# Altium schematic sheet ST_All.SchDoc
size A4
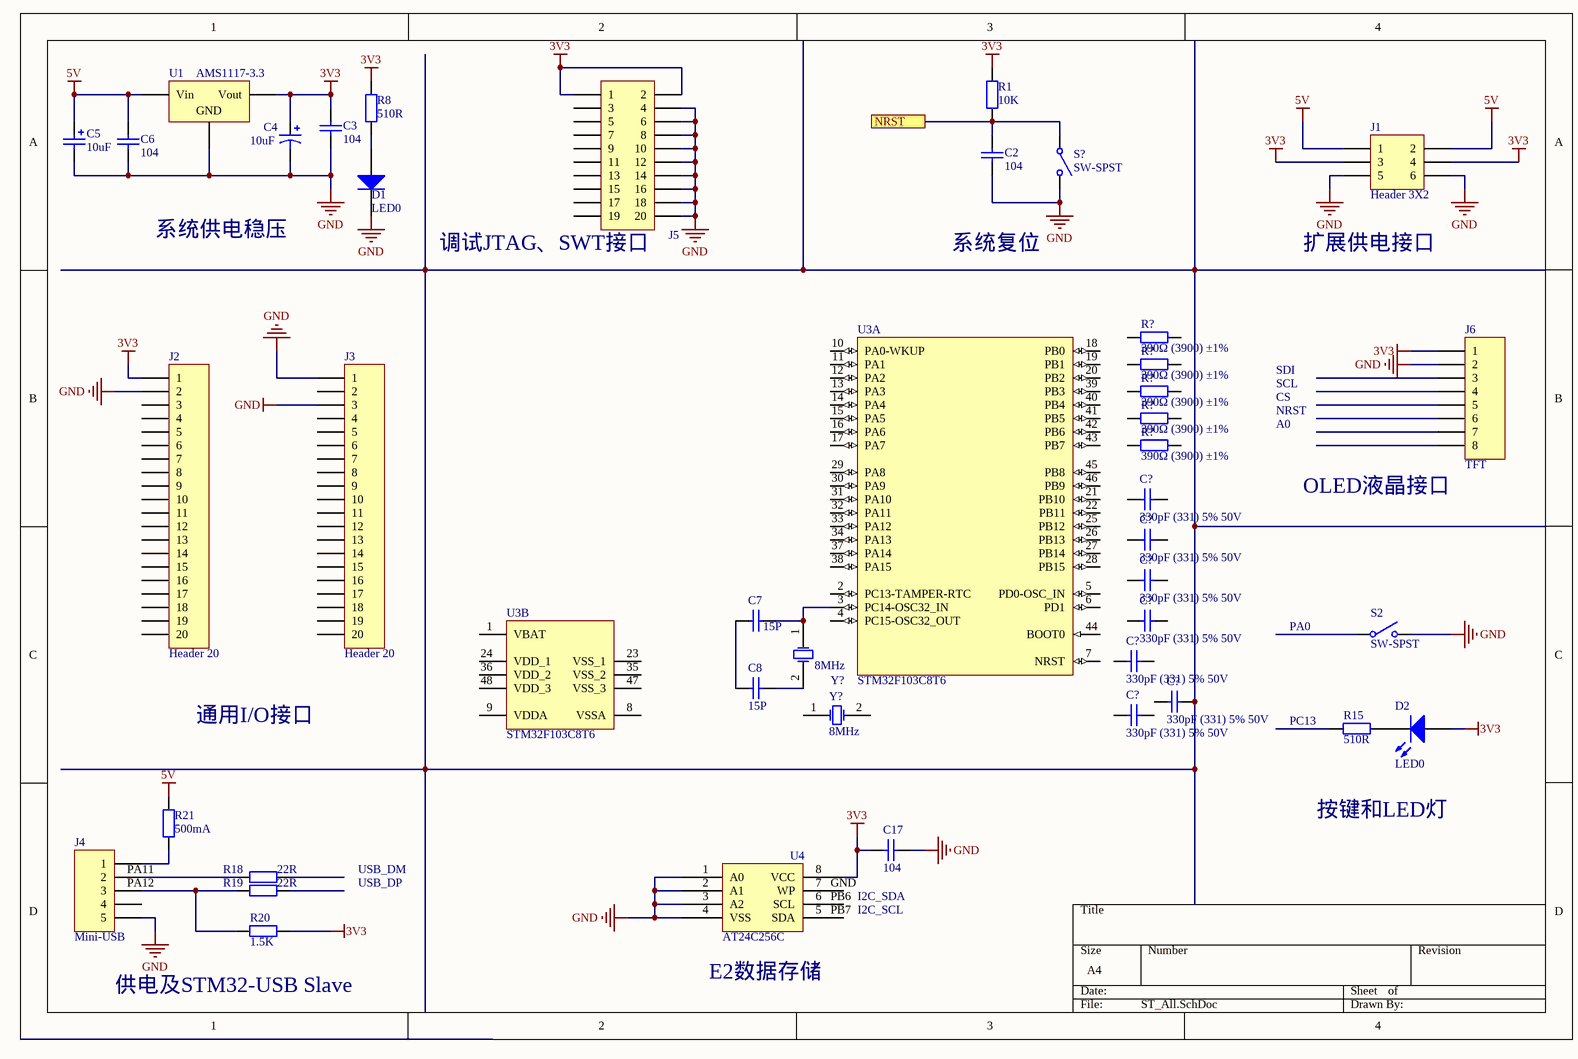
[diagram p0: ST_All.SchDoc]

## Parts
(Parts that share a designator on the sheet are numbered #1, #2 ... from top to bottom, then left to right.)
C2  104  [0603_C]
C3  104  [0402_C]
C4  10uF  [CC6.56.5]
C5  10uF  [CASE-B_3528]
C6  104  [0402_C]
C7  15P  [0603_C]
C8  15P  [0603_C]
C17  104  [0402_C]
C?#1  330pF (331) 5% 50V  [0603_C]
C?#2  330pF (331) 5% 50V  [0603_C]
C?#3  330pF (331) 5% 50V  [0603_C]
C?#4  330pF (331) 5% 50V  [0603_C]
C?#5  330pF (331) 5% 50V  [0603_C]
C?#6  330pF (331) 5% 50V  [0603_C]
C?#7  330pF (331) 5% 50V  [0603_C]
D1  LED0  [SMC(DO-214AB)_S1]
D2  LED0  [0603_LED_S1]
J1  Header 3X2  [MHDR2X3]
J2  Header 20  [HDR1X20]
J3  Header 20  [HDR1X20]
J4  Mini-USB  [HDR1X5]
J5  (no value)  [MHDR2X10]
J6  TFT  [MHDR1X8]
R1  10K  [0603_R]
R8  510R  [0402_R]
R15  510R  [0805_R]
R18  22R  [0402_R]
R19  22R  [0402_R]
R20  1.5K  [0402_R]
R21  500mA  [0402_R]
R?#1  390Ω (3900) ±1%  [0603_R]
R?#2  390Ω (3900) ±1%  [0603_R]
R?#3  390Ω (3900) ±1%  [0603_R]
R?#4  390Ω (3900) ±1%  [0603_R]
R?#5  390Ω (3900) ±1%  [0603_R]
S2  SW-SPST  [SPST-2]
S?  SW-SPST  [SPST-2]
U1  AMS1117-3.3  [SOT-223]
U3  STM32F103C8T6  [LQFP-48_7x7x05P]  (parts A,B of 2)
U4  AT24C256C  [SOP8_L]
Y?#1  8MHz  [XTAL_US]
Y?#2  8MHz  [XTAL_US]

## Ports
NRST

## Nets
3V3: C3.1 C4.2 C17.1 D2.A J1.3 J1.4 J2.1 J5.1 J5.2 J6.1 R1.2 R8.2 R20.2 U1.2(Vout) U4.8(VCC)
5V: C5.1 C6.2 J1.1 J1.2 R21.2 U1.3(Vin)
GND: C2.1 C3.2 C4.1 C5.2 C6.1 C17.2 D1.2(K) J1.5 J1.6 J2.2 J3.1 J3.3 J4.1(5) J5.4 J5.6 J5.8 J5.10 J5.12 J5.14 J5.16 J5.18 J5.20 J6.2 S2.2(NO) S?.2(NO) U1.1(GND) U4.1(A0) U4.2(A1) U4.3(A2) U4.4(VSS)
NRST: C2.2 R1.1 S?.1(COMMON) ; port NRST
NetC7_1: C7.1 C8.1
NetC7_2: C7.2 U3.3(PC14-OSC32_IN) Y?#1.1(OSC1)
NetC8_2: C8.2 Y?#1.2(OSC2)
NetD1_1: D1.1(A) R8.1
NetD2_K: D2.K R15.2
NetJ4_5: J4.5(1) R21.1
NetJ4_PA11: J4.PA11(2) R18.1
NetJ4_PA12: J4.PA12(3) R19.1 R20.1

Not connected (* = marked no-connect by the designer): C?#1 1 2; C?#2 1 2; C?#3 1 2; C?#4 1 2; C?#5 1 2; C?#6 1 2; C?#7 1 2; J2 PA0(8) PA1(9) PA2(10) PA3(11) PA4(12) PA5(13) PA6(14) PA7(15) PB0(16) PB1(17) PB2(18) PB10(19) PB11(20) PC13(4) PC14(5) PC15(6) VBAT(3) VDDA(7); J3 BOOT0(2) PA8(16) PA9(15) PA10(14) PA11(13) PA12(12) PB5(8) PB6(7) PB7(6) PB8(5) PB9(4) PB12(20) PB13(19) PB14(18) PB15(17) TD0/PB3(10) TD1/PA15(11) TRST/PB4(9); J4 2(4); J5 11 17 19 NRST(15) TCLK(9) TDI/PA15(5) TDO/PB3(13) TMS(7) TRST/PB4(3); J6 8 NRST(6) PB1(7) PB12(5) PB13(4) PB15(3); R15 1; R18 2; R19 2; R?#1 1 2; R?#2 1 2; R?#3 1 2; R?#4 1 2; R?#5 1 2; S2 1(COMMON); U3 1(VBAT) 2(PC13-TAMPER-RTC) 4(PC15-OSC32_OUT) 5(PD0-OSC_IN) 6(PD1) 7(NRST) 8(VSSA) 9(VDDA) 10(PA0-WKUP) 11(PA1) 12(PA2) 13(PA3) 14(PA4) 15(PA5) 16(PA6) 17(PA7) 18(PB0) 19(PB1) 20(PB2) 21(PB10) 22(PB11) 23(VSS_1) 24(VDD_1) 25(PB12) 26(PB13) 27(PB14) 28(PB15) 29(PA8) 30(PA9) 31(PA10) 32(PA11) 33(PA12) 34(PA13) 35(VSS_2) 36(VDD_2) 37(PA14) 38(PA15) 39(PB3) 40(PB4) 41(PB5) 42(PB6) 43(PB7) 44(BOOT0) 45(PB8) 46(PB9) 47(VSS_3) 48(VDD_3); U4 5   PB7(SDA) 6   PB6(SCL) 7   GND(WP); Y?#2 1(OSC1) 2(OSC2)

## Notes on the sheet
- 系统供电稳压
- (near J5) 调试JTAG、SWT接口
- 系统复位
- 扩展供电接口
- SDI
- SCL
- CS
- NRST
- A0
- OLED液晶接口
- PA0
- 通用I/O接口
- (near R15) PC13
- 按键和LED灯
- USB_DM
- USB_DP
- I2C_SDA
- I2C_SCL
- 供电及STM32-USB Slave
- (near U4) E2数据存储

## Library data of the parts
C2 = 0603 2.2nF (222) 10% 50V: 贴片电容; ComponentLink1Description: 供应商链接; ComponentLink1URL: http://www.szlcsc.com/product/details_1956.html; Package: 0603; Supplier: LC; SuppliersPartNumber: C1604
C3 C6 = 0402 1.0uF (105) 10% 25V: 贴片电容; ComponentLink1Description: 供应商链接; ComponentLink1URL: http://www.szlcsc.com/product/details_53938.html; Package: 0402; Supplier: LC; SuppliersPartNumber: C52923
C4 = Cp: Polarized Capacitor (Axial); Published: 8-Jun-2000; LatestRevisionDate: 17-Jul-2002; LatestRevisionNote: Re-released for DXP Platform.; PackageReference: POLAR0.8; Publisher: Altium Limited; PackageDescription: Polarized Capacitor; 2 Leads
C5 = 3528 100uF (107) 10% 6.3V: 钽电容; ComponentLink1Description: 供应商链接; ComponentLink1URL: http://www.szlcsc.com/product/details_16815.html; Package: 3528; Supplier: LC; SuppliersPartNumber: C16133
C7 C8 C?#1-C?#7 = 0603 330pF (331) 5% 50V: 贴片电容; ComponentLink1Description: 供应商链接; ComponentLink1URL: http://www.szlcsc.com/product/details_2016.html; Package: 0603; Supplier: LC; SuppliersPartNumber: C1664
C17 = 0402 470pF (471) 10% 50V: 贴片电容; ComponentLink1Description: 供应商链接; ComponentLink1URL: http://www.szlcsc.com/product/details_1889.html; Package: 0402; Supplier: LC; SuppliersPartNumber: C1537
D1 = SMC(DO-214AB) SS36-E3/57T: 二极管; ComponentLink1Description: 供应商链接; ComponentLink1URL: http://www.szlcsc.com/product/details_36698.html; Package: SMC(DO-214AB); Supplier: LC; SuppliersPartNumber: C35722
D2 = 0603 蓝灯: 发光二极管; ComponentLink1Description: 供应商链接; ComponentLink1URL: http://www.szlcsc.com/product/details_73150.html; Package: 0603; Supplier: LC; SuppliersPartNumber: C72041
J1 = MHDR2X3: Header, 3-Pin, Dual row; LatestRevisionDate: 17-Jul-2002; LatestRevisionNote: Re-released for DXP Platform.; Publisher: Altium Limited
J2 J3 = Header 20: Header, 20-Pin; LatestRevisionDate: 17-Jul-2002; LatestRevisionNote: Re-released for DXP Platform.; Publisher: Altium Limited
J4 = Header 5: Header, 5-Pin; LatestRevisionDate: 17-Jul-2002; LatestRevisionNote: Re-released for DXP Platform.; Publisher: Altium Limited
J5 = MHDR2X10: Header, 10-Pin, Dual row; LatestRevisionDate: 17-Jul-2002; LatestRevisionNote: Re-released for DXP Platform.; Publisher: Altium Limited
J6 = MHDR1X8: Header, 8-Pin; LatestRevisionDate: 17-Jul-2002; LatestRevisionNote: Re-released for DXP Platform.; Publisher: Altium Limited
R1 = 0603 2.2MΩ (2204) 1%: 贴片电阻; ComponentLink1Description: 供应商链接; ComponentLink1URL: http://www.szlcsc.com/product/details_23665.html; Package: 0603; Supplier: LC; SuppliersPartNumber: C22938
R8 = 0402 1KΩ (1001) 1%: 贴片电阻; ComponentLink1Description: 供应商链接; ComponentLink1URL: http://www.szlcsc.com/product/details_12256.html; Package: 0402; Supplier: LC; SuppliersPartNumber: C11702
R15 = 0805 200Ω (2000) 1%: 贴片电阻; ComponentLink1Description: 供应商链接; ComponentLink1URL: http://www.szlcsc.com/product/details_18228.html; Package: 0805; Supplier: LC; SuppliersPartNumber: C17540
R18-R21 = 0402 470KΩ (4703) 1%: 贴片电阻; ComponentLink1Description: 供应商链接; ComponentLink1URL: http://www.szlcsc.com/product/details_26533.html; Package: 0402; Supplier: LC; SuppliersPartNumber: C25790
R?#1-R?#5 = 0603 390Ω (3900) 1%: 贴片电阻; ComponentLink1Description: 供应商链接; ComponentLink1URL: http://www.szlcsc.com/product/details_23878.html; Package: 0603; Supplier: LC; SuppliersPartNumber: C23151
S2 S? = SW-SPST: Single-Pole, Single-Throw Switch; Published: 24-Mar-1999; LatestRevisionDate: 17-Jul-2002; LatestRevisionNote: Re-released for DXP Platform.; PackageReference: SPST-2; Publisher: Altium Limited
U1 = SOT-223 AMS1117-3.3: 低压差线性稳压(LDO); ComponentLink1Description: 供应商链接; ComponentLink1URL: http://www.szlcsc.com/product/details_6652.html; Package: SOT-223; Supplier: LC; SuppliersPartNumber: C6186
U3 = STM32F103C8T6: ARM; ComponentLink1Description: 供应商链接; ComponentLink1URL: http://www.szlcsc.com/product/details_9243.html; Package: LQFP-48_7x7x05P; Supplier: LC; SuppliersPartNumber: C8734
U4 = AT24C256C: EEPROM; ComponentLink1Description: 供应商链接; ComponentLink1URL: http://www.szlcsc.com/product/details_6947.html; Package: SOIC-8_150mil; Supplier: LC; SuppliersPartNumber: C6482
Y?#1 Y?#2 = XTAL: Crystal Oscillator; Published: 8-Jun-2000; LatestRevisionDate: 17-Jul-2002; LatestRevisionNote: Re-released for DXP Platform.; Publisher: Altium Limited